# EAGLE design atf22_breakout (EAGLE 9.2.0)
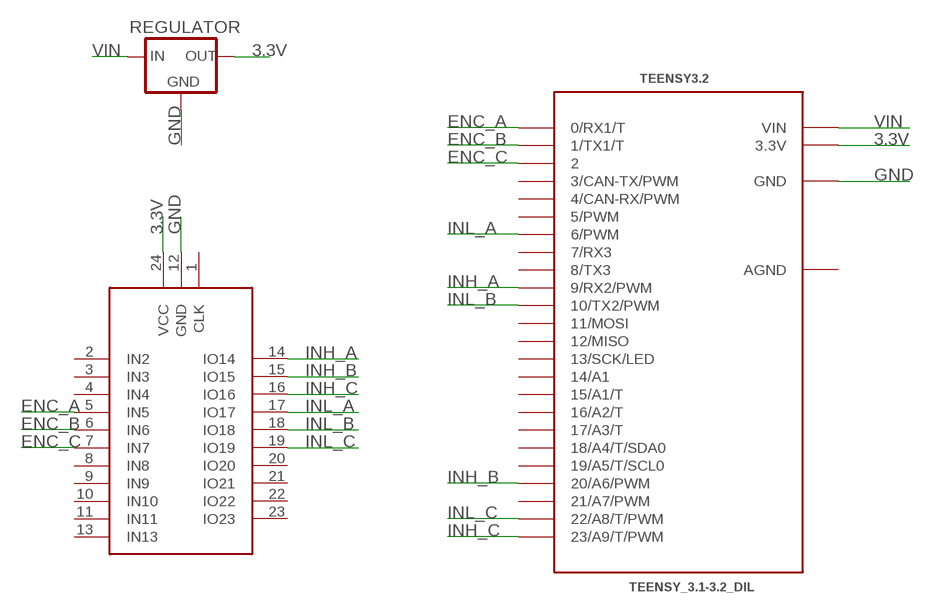
[diagram p0: schematic, sheet 1]

## Parts
ATF22  ATF22  [PDIP-T24]
REGULATOR  V_REG_78XXR-78E  [V78W]
TEENSY3.2  TEENSY_3.1-3.2_DIL  [TEENSY_3.0-3.2&LC_DIL]

## Nets
3.3V: ATF22.24(VCC) REGULATOR.OUT TEENSY3.2.3.3V
ENC_A: ATF22.5(IN5) TEENSY3.2.0(0/RX1/T)
ENC_B: ATF22.6(IN6) TEENSY3.2.1(1/TX1/T)
ENC_C: ATF22.7(IN7) TEENSY3.2.2
GND: ATF22.12(GND) REGULATOR.GND TEENSY3.2.GND
INH_A: ATF22.14(IO14) TEENSY3.2.9(9/RX2/PWM)
INH_B: ATF22.15(IO15) TEENSY3.2.20/A6(20/A6/PWM)
INH_C: ATF22.16(IO16) TEENSY3.2.23/A9(23/A9/T/PWM)
INL_A: ATF22.17(IO17) TEENSY3.2.6(6/PWM)
INL_B: ATF22.18(IO18) TEENSY3.2.10(10/TX2/PWM)
INL_C: ATF22.19(IO19) TEENSY3.2.22/A8(22/A8/T/PWM)
VIN: REGULATOR.IN TEENSY3.2.VIN
Unconnected: ATF22.1(CLK) ATF22.2(IN2) ATF22.3(IN3) ATF22.4(IN4) ATF22.8(IN8) ATF22.9(IN9) ATF22.10(IN10) ATF22.11(IN11) ATF22.13(IN13) ATF22.20(IO20) ATF22.21(IO21) ATF22.22(IO22) ATF22.23(IO23) TEENSY3.2.3(3/CAN-TX/PWM) TEENSY3.2.4(4/CAN-RX/PWM) TEENSY3.2.5(5/PWM) TEENSY3.2.7(7/RX3) TEENSY3.2.8(8/TX3) TEENSY3.2.11(11/MOSI) TEENSY3.2.12(12/MISO) TEENSY3.2.13(13/SCK/LED) TEENSY3.2.14/A0(14/A1) TEENSY3.2.15/A1(15/A1/T) TEENSY3.2.16/A2(16/A2/T) TEENSY3.2.17/A3(17/A3/T) TEENSY3.2.18/A4(18/A4/T/SDA0) TEENSY3.2.19/A5(19/A5/T/SCL0) TEENSY3.2.21/A7(21/A7/PWM)

## Power pins joined to a net without a drawn wire
AGND: TEENSY3.2.AGND

## Library data of the parts
ATF22 = Custom_old:ATF22
REGULATOR = 2018:V_REG_78XX: Voltage Regulator Standard 7805 5V regulator. IGO (Input Ground Output). Spark Fun Electronics SKU : COM-00107
TEENSY3.2 = Teensy:TEENSY_3.1-3.2_DIL: Teensy 3.1 or 3.2 in a DIL Layout.

## Board
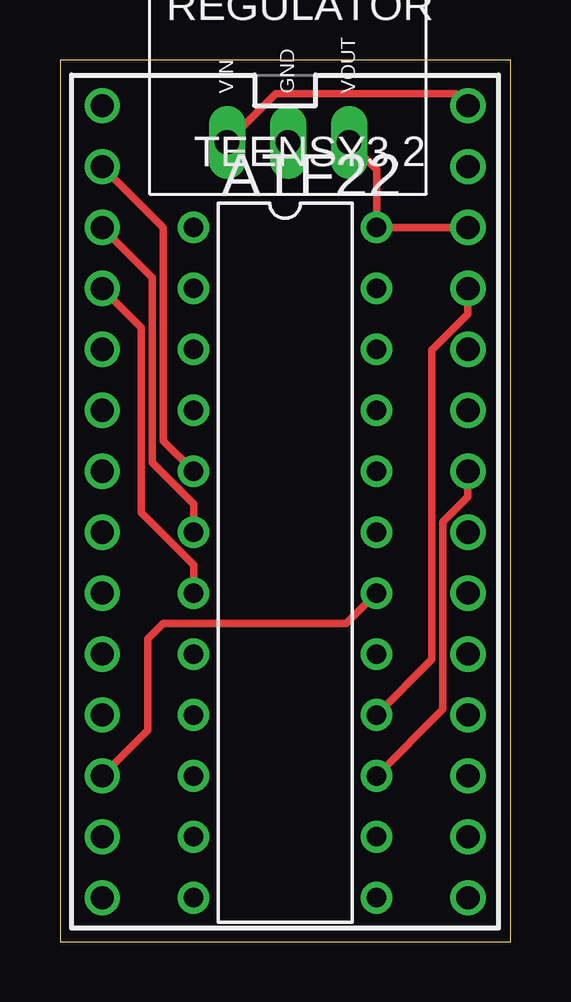
[diagram p1: board, top side]
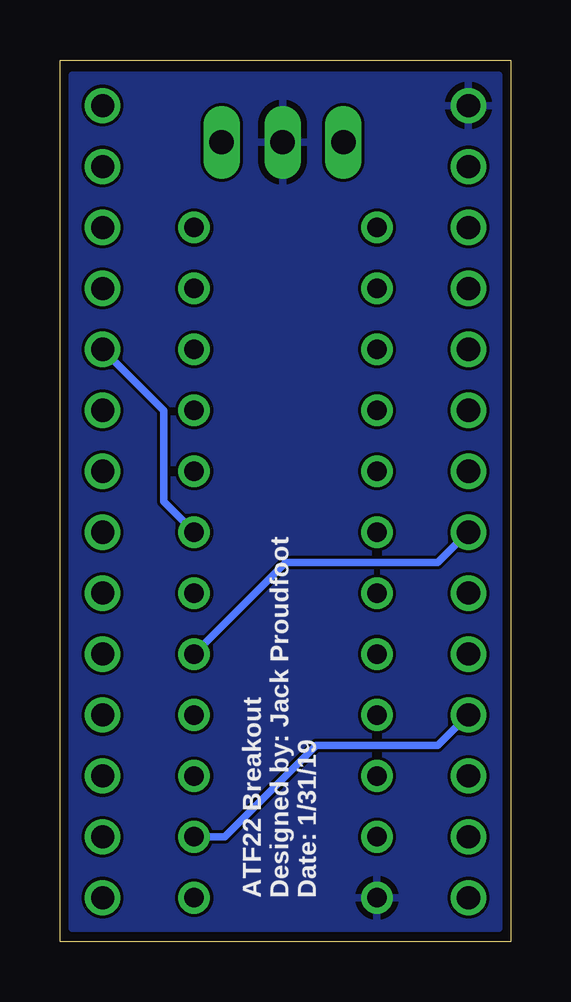
[diagram p2: board, bottom side, seen from below]

Size 18.78 x 36.75 mm. Coordinates in mm from the lower left corner, seen from the top.
Outline: 18.78,36.75 0,36.75 0,0 18.78,0 18.78,36.75
Copper layers (1*16): Top 0.035mm / dielectric 1.5mm / Bottom 0.035mm
Design rules "gerry-jlcpcb_tight": minimum track width 5mil, minimum drill 0.3mm, track to track 5mil, track to pad 5mil, pad to pad 5mil, via to via 5mil, smd to smd 0mil, copper to edge 0.2mm, drill to drill 6mil, minimum pad ring 10mil, minimum via ring 0.15mm, stop-mask expansion 4mil, vias tented up to drill 0.35mm, thermal gap 10mil

### Footprints (pad centres in the part's own frame; a part is rotated, then mirrored left to right if it is on the bottom)
PDIP-T24 = drill 0.813 pad 1.2: 1 -13.97,-3.81; 2 -11.43,-3.81; 3 -8.89,-3.81; 4 -6.35,-3.81; 5 -3.81,-3.81; 6 -1.27,-3.81; 7 1.27,-3.81; 8 3.81,-3.81; 9 6.35,-3.81; 10 8.89,-3.81; 11 11.43,-3.81; 12 13.97,-3.81; 13 13.97,3.81; 14 11.43,3.81; 15 8.89,3.81; 16 6.35,3.81; 17 3.81,3.81; 18 1.27,3.81; 19 -1.27,3.81; 20 -3.81,3.81; 21 -6.35,3.81; 22 -8.89,3.81; 23 -11.43,3.81; 24 -13.97,3.81
V78W = drill 1.016 long: GND 0,-3.81; IN -2.54,-3.81; OUT 2.54,-3.81
TEENSY_3.0-3.2&LC_DIL = drill 0.965: 0 -7.62,13.97; 1 -7.62,11.43; 2 -7.62,8.89; 3 -7.62,6.35; 3.3V 7.62,11.43; 4 -7.62,3.81; 5 -7.62,1.27; 6 -7.62,-1.27; 7 -7.62,-3.81; 8 -7.62,-6.35; 9 -7.62,-8.89; 10 -7.62,-11.43; 11 -7.62,-13.97; 12 -7.62,-16.51; 13 7.62,-16.51; 14/A0 7.62,-13.97; 15/A1 7.62,-11.43; 16/A2 7.62,-8.89; 17/A3 7.62,-6.35; 18/A4 7.62,-3.81; 19/A5 7.62,-1.27; 20/A6 7.62,1.27; 21/A7 7.62,3.81; 22/A8 7.62,6.35; 23/A9 7.62,8.89; AGND 7.62,13.97; GND -7.62,16.51; VIN 7.62,16.51

### Placement (x,y rotation side)
ATF22  9.38,15.8 270 top
REGULATOR  9.51,37.13 0 top
TEENSY3.2  9.38,18.34 0 top
U$1  [DEV]  6.84,18.34 90 bottom

### Tracks (layer width: path | path; a pad name or v marks a point on that pad's centre or on a via)
3.3V
  Top 0.305: REGULATOR.OUT 13.19,32.18 ATF22.24 TEENSY3.2.3.3V
ENC_A
  Top 0.305: ATF22.5 4.3,20.88 4.3,29.77 TEENSY3.2.0
ENC_B
  Top 0.305: TEENSY3.2.1 3.84,27.69 3.84,19.97 5.57,18.24 ATF22.6
ENC_C
  Top 0.305: TEENSY3.2.2 3.38,25.6 3.38,17.89 5.57,15.7 ATF22.7
GND
  pour Bottom: 18.27,36.12 18.27,0.56 0.49,0.56 0.49,36.12
INH_A
  Bottom 0.305: ATF22.14 11.92,4.37 8.11,8.18 3.03,8.18 TEENSY3.2.9
INH_B
  Top 0.305: ATF22.15 15.96,9.68 15.96,17.5 17,18.54 TEENSY3.2.20/A6
INH_C
  Top 0.305: ATF22.16 15.5,11.76 15.5,24.66 17,26.16 TEENSY3.2.23/A9
INL_A
  Bottom 0.305: ATF22.17 9.38,15.8 3.03,15.8 TEENSY3.2.6
INL_B
  Top 0.305: ATF22.18 11.92,13.26 4.3,13.26 3.66,12.62 3.66,8.81 TEENSY3.2.10
INL_C
  Bottom 0.305: TEENSY3.2.22/A8 14.46,22.15 14.46,18.34 ATF22.19
VIN
  Top 0.305: REGULATOR.IN 9,35.36 16.49,35.36 TEENSY3.2.VIN

### Text on the board
bPlace: ATF22 Breakout / Designed by: Jack Proudfoot / Date: 1/31/19